# Altium project fyp_drone_V3.PrjPcb
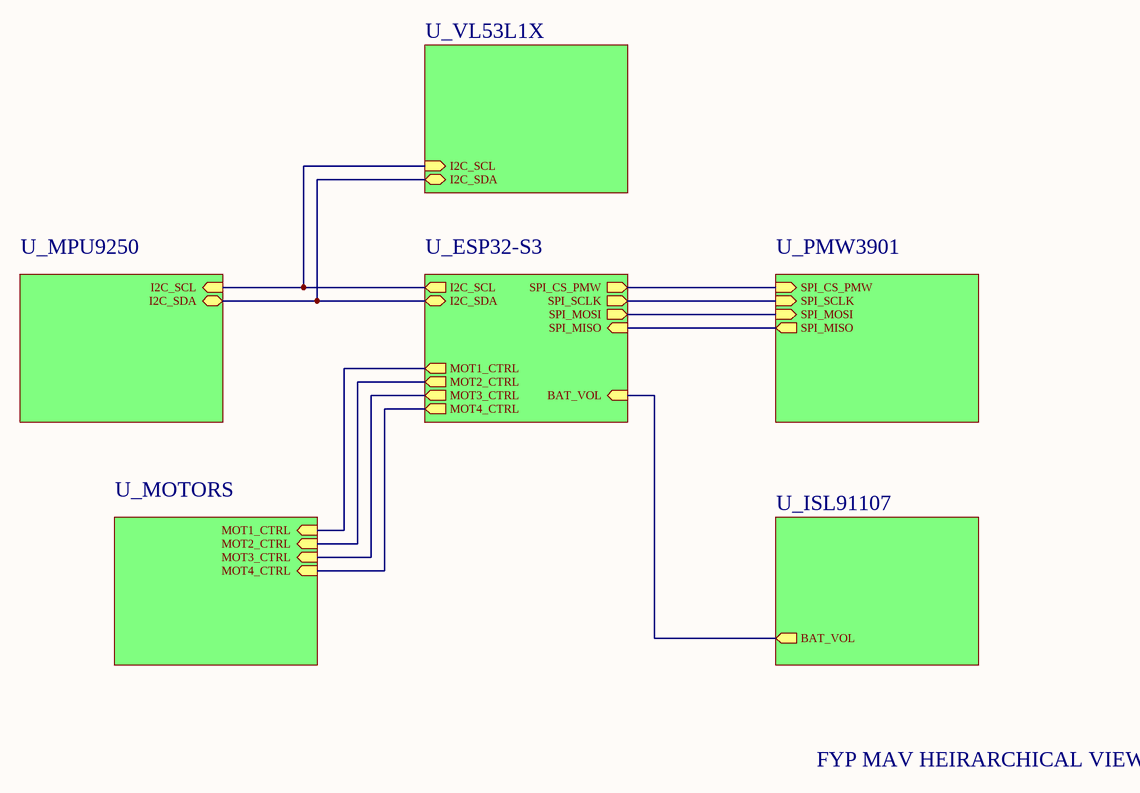
[diagram p0: TOP.SchDoc]
7 sheets, 66 parts. Net scope: hierarchical (ports join the sheet entries above them; power ports are global).
Board file: PCB1.PcbDoc
Sheets:
  TOP.SchDoc
    U_ESP32-S3 = ESP32-S3.SchDoc
    U_MPU9250 = MPU9250.SchDoc
    U_PMW3901 = PMW3901.SchDoc
    U_ISL91107 = ISL91107.SchDoc
    U_VL53L1X = VL53L1X.SchDoc
    U_MOTORS = MOTORS.SchDoc

## Sheet TOP.SchDoc
size A4; SheetNumber: 1; SheetTotal: 7

### Sub-sheets
U_ESP32-S3 = ESP32-S3.SchDoc: I2C_SDA (bidir), I2C_SCL (out), SPI_CS_PMW (out), SPI_MISO (in), SPI_SCLK (out), SPI_MOSI (out), BAT_VOL (in), MOT2_CTRL (out), MOT1_CTRL (out), MOT4_CTRL (out), MOT3_CTRL (out)
U_ISL91107 = ISL91107.SchDoc: BAT_VOL (out)
U_MOTORS = motors.SchDoc: MOT1_CTRL (in), MOT2_CTRL (in), MOT3_CTRL (in), MOT4_CTRL (in)
U_MPU9250 = MPU9250.schdoc: I2C_SCL (in), I2C_SDA (bidir)
U_PMW3901 = PMW3901.SchDoc: SPI_CS_PMW (in), SPI_MISO (out), SPI_SCLK (in), SPI_MOSI (in)
U_VL53L1X = VL53L1X.SchDoc: I2C_SDA (bidir), I2C_SCL (in)

### Nets
BAT_VOL: sheet U_ESP32-S3/BAT_VOL, sheet U_ISL91107/BAT_VOL
I2C_SCL: sheet U_ESP32-S3/I2C_SCL, sheet U_MPU9250/I2C_SCL, sheet U_VL53L1X/I2C_SCL
I2C_SDA: sheet U_ESP32-S3/I2C_SDA, sheet U_MPU9250/I2C_SDA, sheet U_VL53L1X/I2C_SDA
MOT1_CTRL: sheet U_ESP32-S3/MOT1_CTRL, sheet U_MOTORS/MOT1_CTRL
MOT2_CTRL: sheet U_ESP32-S3/MOT2_CTRL, sheet U_MOTORS/MOT2_CTRL
MOT3_CTRL: sheet U_ESP32-S3/MOT3_CTRL, sheet U_MOTORS/MOT3_CTRL
MOT4_CTRL: sheet U_ESP32-S3/MOT4_CTRL, sheet U_MOTORS/MOT4_CTRL
SPI_CS_PMW: sheet U_ESP32-S3/SPI_CS_PMW, sheet U_PMW3901/SPI_CS_PMW
SPI_MISO: sheet U_ESP32-S3/SPI_MISO, sheet U_PMW3901/SPI_MISO
SPI_MOSI: sheet U_ESP32-S3/SPI_MOSI, sheet U_PMW3901/SPI_MOSI
SPI_SCLK: sheet U_ESP32-S3/SPI_SCLK, sheet U_PMW3901/SPI_SCLK

### Notes on the sheet
- FYP MAV HEIRARCHICAL VIEW

## Sheet ESP32-S3.SchDoc
size A4; SheetNumber: 2; SheetTotal: 7
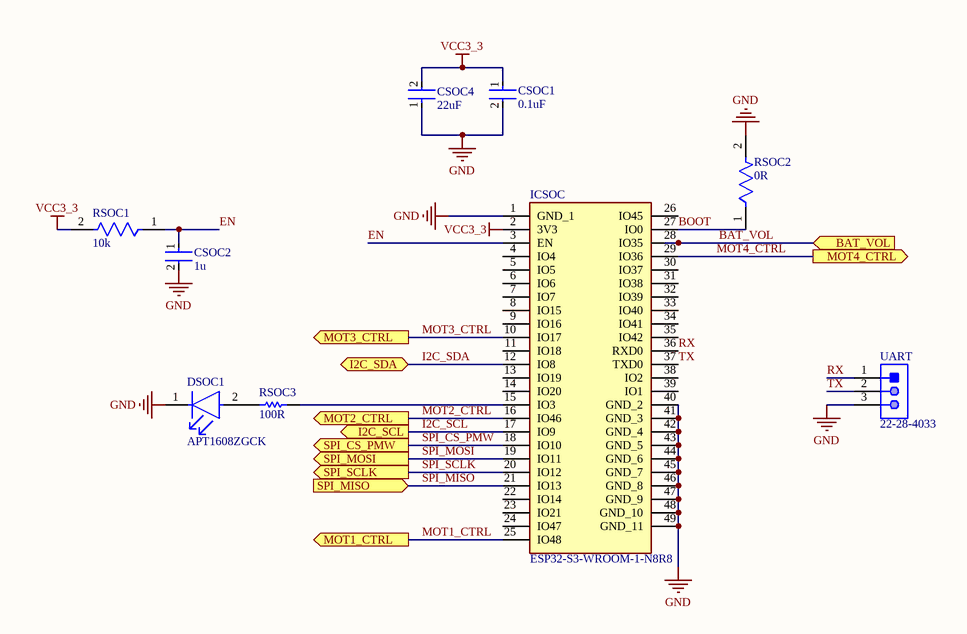
[diagram p1: ESP32-S3.SchDoc]

### Parts
CSOC1  0.1uF  [FP-CL10-IPC_C]
CSOC2  1u  [FP-CL10-IPC_A]
CSOC4  22uF  [FP-GRM188-0_2-IPC_C]
DSOC1  APT1608ZGCK  [FP-APT1608ZGCK-MFG]
ICSOC  ESP32-S3-WROOM-1-N8R8  [ESP32S3WROOM1N8R8]
RSOC1  10k  [FP-ERJ3G-IPC_C]
RSOC2  0R  [FP-ERJ-3GEY0R00V-MFG]
RSOC3  100R  [RESC1608X55X30LL15T15]
UART  22-28-4033  [MOLX-22-28-4033_V]

### Ports
BAT_VOL (in), I2C_SCL (out), I2C_SDA (bidir), MOT1_CTRL (out), MOT2_CTRL (out), MOT3_CTRL (out), MOT4_CTRL (out), SPI_CS_PMW (out), SPI_MISO (in), SPI_MOSI (out), SPI_SCLK (out)

### Nets
GND: CSOC1.2 CSOC2.2 CSOC4.1 DSOC1.1(C) ICSOC.1(GND_1) ICSOC.40(GND_2) ICSOC.41(GND_3) ICSOC.42(GND_4) ICSOC.43(GND_5) ICSOC.44(GND_6) ICSOC.45(GND_7) ICSOC.46(GND_8) ICSOC.47(GND_9) ICSOC.48(GND_10) ICSOC.49(GND_11) RSOC2.2 UART.3
VCC3_3: CSOC1.1 CSOC4.2 ICSOC.2(3V3) RSOC1.2  [project net AVDD]
BAT_VOL: ICSOC.28(IO35) ; port BAT_VOL
BOOT: ICSOC.27(IO0) RSOC2.1
EN: CSOC2.1 ICSOC.3(EN) RSOC1.1
I2C_SCL: ICSOC.17(IO9) ; port I2C_SCL
I2C_SDA: ICSOC.12(IO8) ; port I2C_SDA
MOT1_CTRL: ICSOC.25(IO48) ; port MOT1_CTRL
MOT2_CTRL: ICSOC.16(IO46) ; port MOT2_CTRL
MOT3_CTRL: ICSOC.10(IO17) ; port MOT3_CTRL
MOT4_CTRL: ICSOC.29(IO36) ; port MOT4_CTRL
RX: ICSOC.36(RXD0) UART.1
SPI_CS_PMW: ICSOC.18(IO10) ; port SPI_CS_PMW
SPI_MISO: ICSOC.21(IO13) ; port SPI_MISO
SPI_MOSI: ICSOC.19(IO11) ; port SPI_MOSI
SPI_SCLK: ICSOC.20(IO12) ; port SPI_SCLK
TX: ICSOC.37(TXD0) UART.2
NetDSOC1_2: DSOC1.2(A) RSOC3.2
NetICSOC_15: ICSOC.15(IO3) RSOC3.1

Not connected (* = marked no-connect by the designer): ICSOC 4(IO4) 5(IO5) 6(IO6) 7(IO7) 8(IO15) 9(IO16) 11(IO18) 13(IO19) 14(IO20) 22(IO14) 23(IO21) 24(IO47) 26(IO45) 30(IO37) 31(IO38) 32(IO39) 33(IO40) 34(IO41) 35(IO42) 38(IO2) 39(IO1)

### Library data of the parts
CSOC1 = CMP-13271-001724-1: Cap Ceramic 100nF 50V X7R ±20% Pad SMD 0603 +125°C T/R; Mount: Surface Mount; Lead Free: Lead Free; Max Operating Temperature: 125°C; Voltage Rating: 50V; Case Code (Imperial): 0603; Capacitance: 100nF; Height: 0.8mm; Length: 1.6mm; Tolerance: 20%; Case Code (Metric): 1608; Thickness: 0.035inch; Depth: 0.8mm; Width: 0.031inch; Package Quantity: 1; Min Operating Temperature: -55°C; Case/Package: 0603; Radiation Hardening: No; Voltage Rating (DC): 50V; Dielectric: X7R; Packaging: Tape and Reel
CSOC2 = CMP-13271-001174-1: Cap Ceramic 1uF 25V X5R ±10% Pad SMD 0603 +85°C T/R; Min Operating Temperature: -55°C; Dielectric: X5R; Mount: Surface Mount; Lead Free: Lead Free; Capacitance: 1uF; Height: 0.8mm; Case/Package: 0603; Depth: 0.8mm; Radiation Hardening: No; Width: 0.031inch; Tolerance: 10%; Voltage Rating: 25V; Thickness: 0.035inch; Max Operating Temperature: 85°C; Packaging: Tape and Reel; Package Quantity: 15000; Length: 1.6mm; Voltage Rating (DC): 25V
CSOC4 = CMP-2000-06337-3: Chip Multilayer Ceramic Capacitors for General Purpose, 0603, 22uF, X5R, 15%, 20%, 10V; Tolerance: 20%; Weight: 0.000222oz; Material: Ceramic; Depth: 0.8mm; Length: 1.6mm; Termination: SMD/SMT; Capacitance: 22uF; Packaging: Tape and Reel; Width: 0.8mm; Voltage Rating: 10V; Case Code (Imperial): 0603; Mount: Surface Mount; Voltage Rating (DC): 10V; Case/Package: 0603; Thickness: 0.039inch; REACH SVHC: No SVHC; Dielectric: X5R; Height: 0.8mm; Package Quantity: 4000; Case Code (Metric): 1608; Min Operating Temperature: -55°C; Lead Free: Lead Free; Max Operating Temperature: 85°C
DSOC1 = CMP-44529-000024-1: LED GREEN CLEAR CHIP SMD; Forward Voltage: 3.3V; Dominant Wavelength: 525nm; Forward Current: 20mA; Lens Color: Colorless; Viewing Angle: 120°; Luminous Intensity: 350mcd; Lens Transparency: Clear; Color: Green; Max Operating Temperature: 85°C; Case/Package: 0603; Mount: Surface Mount; Min Operating Temperature: -40°C; Case Code (Metric): 1608; Test Current: 20mA; Packaging: Tape and Reel; Width: 0.8mm; Package Quantity: 1; Height: 0.75mm; Length: 1.6mm; Illumination Color: Green; Lead Free: Lead Free; Case Code (Imperial): 0603
ICSOC = CMP-006-000000-1: Integrated Circuit; Manufacturer_Name: Espressif Systems; Datasheet Link: https://www.espressif.com/sites/default/files/documentation/esp32-s3-wroom-1_wroom-1u_datasheet_en.pdf; Source: SamacSys.SchLib; Manufacturer_Part_Number: ESP32-S3-WROOM-1-N8R8; Height: 3.25mm; Design Item ID: ESP32-S3-WROOM-1-N8R8
RSOC1 = CMP-2000-00704-2: RES SMD 10K OHM 5% 1/10W 0603; Temperature Coefficient: 200ppm/°C; Max Power Dissipation: 100mW; Resistance: 10kR; Voltage Rating (DC): 50V; Voltage Rating: 75V; Resistor Type: Thick Film; Tolerance: 5%; Military Standard: Not; Package Quantity: 1; Max Operating Temperature: 155°C; Mount: Surface Mount; Technology: THICK FILM; Case/Package: 0603; Construction: Rectangular; Depth: 0.8mm; Case Code (Imperial): 0603; Weight: 7.1E-05oz; Features: Automotive AEC-Q200; Packaging: Tape and Reel; Width: 0.8mm; Length: 1.6mm; Termination: SMD/SMT; Power Rating: 100mW; Lead Free: Lead Free; Number of Terminations: 2; Height: 0.45mm; RoHS Compliant: Yes; Min Operating Temperature: -55°C; Contact Plating: Tin; REACH SVHC: No SVHC; Resistance Tolerance: 5%; Series: ERJ; Working Voltage: 75V; Case Code (Metric): 1608
RSOC2 = CMP-2000-00700-2: RES SMD 0 OHM JUMPER 1/10W 0603; Manufacturer Part Number: ERJ-3GEY0R00V; Manufacturer: Panasonic; Tolerance: 5%; Description: 0 Ohms Jumper 0.1W, 1/10W Chip Resistor 0603 (1608 Metric) Automotive AEC-Q200 Thick Film; Automotive Grade: Grade 0; Voltage Rating: 75V; Value: 0Ω; Temperature Coefficient: -100/+600ppm/°C; Power Rating: 0.1W; Mouser Description: Resistor, Chip Thick Film, 0 Ohm, 0.1w, Resistor, Chip Thick Film, 0 Ohm, 0.1w, 5%; Ipc Land Pattern Name: RESC16080X45; Category: Res; Package: 0603; Temperature: -55°C to +155°C; Temperature Range Low: -55°C; Series: ERJ; Resistance: 0Ω; RoHS: TRUE; Composition: Thick Film; Octopart: https://octopart.com/erj-3gey0r00v-panasonic-55389238; Device Class L1: Passive Components; Footprint Url: https://industrial.panasonic.com/cdbs/www-data/pdf/RDA0000/DMA0000COL17.pdf; ComponentLink2Description: Datasheet; Device Class L2: Resistors; Temperature Range High: +155°C; Digikey Description: RES SMD 0 OHM JUMPER 1/10W 0603; Lead Free: Yes; Device Class L3: Chip SMD Resistors; Height: 0.55mm; ComponentLink2URL: https://industrial.panasonic.com/cdbs/www-data/pdf/RDA0000/AOA0000C301.pdf; Automotive: Yes
RSOC3 = CMP-2000-00179-1: Manufacturer: Panasonic; Part Number: ERJ-3EKF1000V
UART = CMP-1676-00001-5: Male Header, Pitch 2.54 mm, 1 x 3 Position, Height 8.38 mm, Tail Length 3.18 mm, RoHS, Bulk; Manufacturer: Molex; Rows: 1; Voltage Rating: 250 V; Current Rating: 4 A; Min Operating Temperature: 0 degC; Lead Pitch: 0.1 inch; Packaging: Bulk; Contact Finish: Gold; RoHSCompliant: true; Contact Material: Brass; PackageReference: 22-28-4033; REACH SVHC: Unknown; PackageDescription: Male Header, Pitch 2.54 mm, 1 x 3 Position, Height 8.38 mm, Tail Length 3.18 mm; ComponentLink2URL: http://www.molex.com/pdm_docs/sd/022284033_sd.pdf; Height: 8.38 mm; Mounting Technology: Through Hole; ComponentLink1Description: Manufacturer URL; Length: 7.62 mm; Mount: Through Hole; DatasheetVersion: Rev. G, 01/2012; Max Operating Temperature: 75 degC; ComponentLink2Description: Datasheet; Colour: Black; Pins: 3; Contact Plating: Gold; Package Quantity: 1; ComponentLink1URL: http://www.molex.com/

## Sheet MPU9250.SchDoc
size A4; SheetNumber: 3; SheetTotal: 7
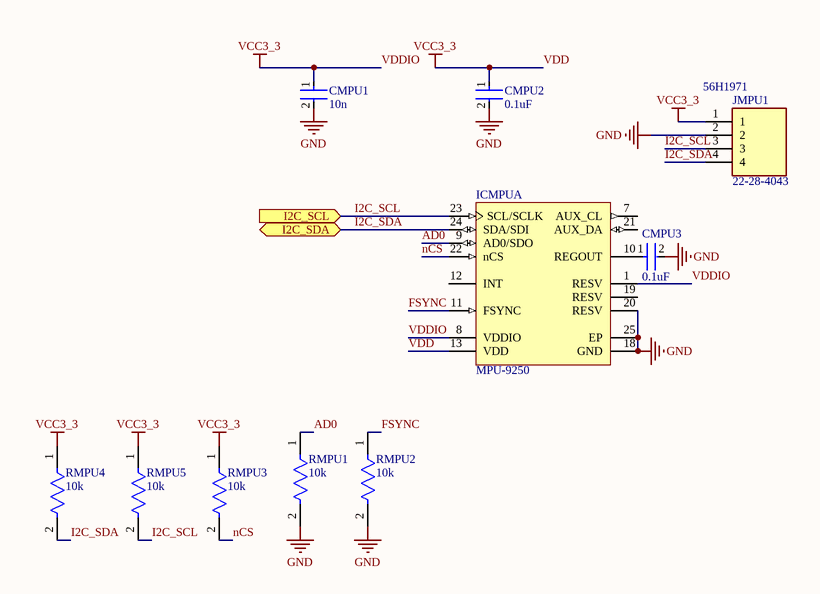
[diagram p2: MPU9250.SchDoc]

### Parts
CMPU1  10n  [FP-CL10-IPC_A]
CMPU2  0.1uF  [FP-CL10-IPC_C]
CMPU3  0.1uF  [FP-CL10-IPC_C]
ICMPU  MPU-9250  [INSE-QFN-24-1700X1540TP_M]  (part A of 2)
JMPU1  22-28-4043  Supplier Part Number 1: 56H1971  [HDRV4W87P0X254_1X4_1016X249X863P]
RMPU1  10k  [FP-ERJ3G-IPC_C]
RMPU2  10k  [FP-ERJ3G-IPC_C]
RMPU3  10k  [FP-ERJ3G-IPC_C]
RMPU4  10k  [FP-ERJ3G-IPC_C]
RMPU5  10k  [FP-ERJ3G-IPC_C]

### Ports
I2C_SCL (in), I2C_SDA (bidir)

### Nets
GND: CMPU1.2 CMPU2.2 CMPU3.2 ICMPU.18(GND) ICMPU.20(RESV) ICMPU.25(EP) JMPU1.2 RMPU1.2 RMPU2.2
VCC3_3: CMPU1.1 CMPU2.1 ICMPU.1(RESV) ICMPU.8(VDDIO) ICMPU.13(VDD) JMPU1.1 RMPU3.1 RMPU4.1 RMPU5.1  [also labelled VDD, VDDIO]  [project net AVDD]
AD0: ICMPU.9(AD0/SDO) RMPU1.1
FSYNC: ICMPU.11(FSYNC) RMPU2.1
I2C_SCL: ICMPU.23(SCL/SCLK) JMPU1.3 RMPU5.2 ; port I2C_SCL
I2C_SDA: ICMPU.24(SDA/SDI) JMPU1.4 RMPU4.2 ; port I2C_SDA
nCS: ICMPU.22(nCS) RMPU3.2
NetCMPU3_1: CMPU3.1 ICMPU.10(REGOUT)

Not connected (* = marked no-connect by the designer): ICMPU 7(AUX_CL) 12(INT) 19(RESV) 21(AUX_DA)

### Library data of the parts
CMPU1 = CMP-13271-001215-1: Cap Ceramic 10nF 50V X7R ±10% Pad SMD 0603 +125°C T/R; Dielectric: X7R; Features: Soft Termination; Packaging: Tape and Reel; Voltage Rating: 50V; Ratings: AEC-Q200; Radiation Hardening: No; Height: 0.8mm; Package Quantity: 4000; Case Code (Metric): 1608; Capacitance: 10nF; Length: 1.6mm; Width: 0.031inch; Case/Package: 0603; Thickness: 0.035inch; Tolerance: 10%; Max Operating Temperature: 125°C; Lead Free: Lead Free; Mount: Surface Mount; Min Operating Temperature: -55°C; Case Code (Imperial): 0603; Voltage: 50V; Depth: 0.8mm
CMPU2 CMPU3 = CMP-13271-001724-1: as CSOC1 on sheet ESP32-S3; Mount: Surface Mount; Lead Free: Lead Free; Max Operating Temperature: 125°C; Voltage Rating: 50V; Case Code (Imperial): 0603; Capacitance: 100nF; Height: 0.8mm; Length: 1.6mm; Tolerance: 20%; Case Code (Metric): 1608; Thickness: 0.035inch; Depth: 0.8mm; Width: 0.031inch; Package Quantity: 1; Min Operating Temperature: -55°C; Case/Package: 0603; Radiation Hardening: No; Voltage Rating (DC): 50V; Dielectric: X7R; Packaging: Tape and Reel
ICMPU = CMP-010-00006-3: 9-axis MotionTracking device, 2.4 to 3,6 V, -40 to 85 degC, 24-Pin QFN, RoHS, Tape and Reel; Manufacturer: InvenSense; Sensor Type: Motion; Max Supply Voltage: 3.6V; Min Supply Voltage: 2.4V; Package Description: 24-Pin Quad Flat No-lead Package, Body 3 x 3 mm, Pitch 0.4 mm; RoHS Compliant: True; Datasheet Version: Rev. 1.0, 01/2014; Pins: 24; Mounting Technology: SM; Datasheet URL: http://datasheet.octopart.com/MPU-9250-InvenSense-datasheet-21859386.pdf; Package Quantity: 5000; Package Reference: QFN-24; Case/Package: Module
JMPU1 = 22-28-4043: Connector; Manufacturer_Name: Molex; Datasheet Link: http://www.molex.com/molex/products/datasheet.jsp?part=active/0022284023_PCB_HEADERS.xml; Height: 8.63mm; Manufacturer_Part_Number: 22-28-4043; Mouser Part Number: 538-22-28-4043; Mouser Price/Stock: https://www.mouser.co.uk/ProductDetail/Molex/22-28-4043?qs=MuwpYaHj751%252Bm8qLwZDsXA%3D%3D; Supplier 1: Newark
RMPU1-RMPU5 = CMP-2000-00704-2: as RSOC1 on sheet ESP32-S3; Resistor Type: Thick Film; Tolerance: 5%; Military Standard: Not; Package Quantity: 1; Max Operating Temperature: 155°C; Mount: Surface Mount; Technology: THICK FILM; Case/Package: 0603; Construction: Rectangular; Depth: 0.8mm; Case Code (Imperial): 0603; Weight: 7.1E-05oz; Features: Automotive AEC-Q200; Packaging: Tape and Reel; Width: 0.8mm; Length: 1.6mm; Termination: SMD/SMT; Power Rating: 100mW; Lead Free: Lead Free; Number of Terminations: 2; Height: 0.45mm; RoHS Compliant: Yes; Min Operating Temperature: -55°C; Contact Plating: Tin; REACH SVHC: No SVHC; Resistance Tolerance: 5%; Series: ERJ; Working Voltage: 75V; Case Code (Metric): 1608

## Sheet PMW3901.SchDoc
size A4; SheetNumber: 4; SheetTotal: 7
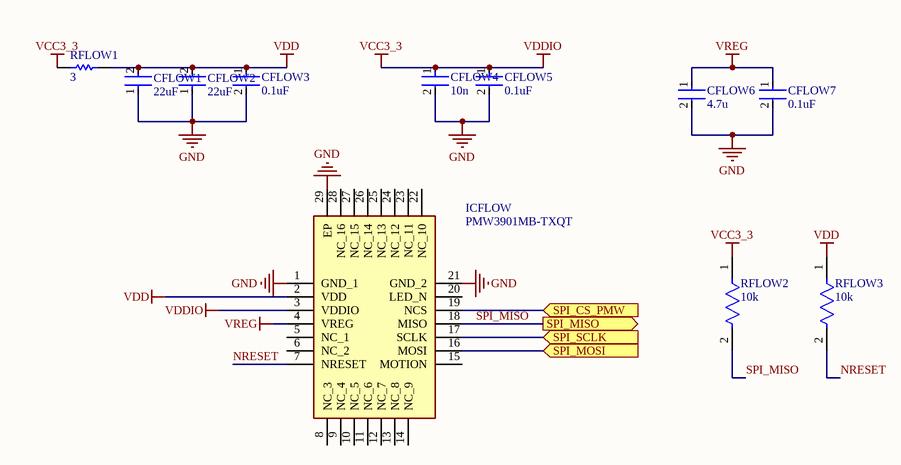
[diagram p3: PMW3901.SchDoc]

### Parts
CFLOW1  22uF  [FP-GRM188-0_2-IPC_C]
CFLOW2  22uF  [FP-GRM188-0_2-IPC_C]
CFLOW3  0.1uF  [FP-CL10-IPC_C]
CFLOW4  10n  [FP-CL10-IPC_A]
CFLOW5  0.1uF  [FP-CL10-IPC_C]
CFLOW6  4.7u  [FP-CL10-IPC_C]
CFLOW7  0.1uF  [FP-CL10-IPC_C]
ICFLOW  PMW3901MB-TXQT  [PMW3901MBTXQT]
RFLOW1  3  [RESC1608X55X30NL15T15]
RFLOW2  10k  [FP-ERJ3G-IPC_C]
RFLOW3  10k  [FP-ERJ3G-IPC_C]

### Ports
SPI_CS_PMW (in), SPI_MISO (out), SPI_MOSI (in), SPI_SCLK (in)

### Nets
GND: CFLOW1.1 CFLOW2.1 CFLOW3.2 CFLOW4.2 CFLOW5.2 CFLOW6.2 CFLOW7.2 ICFLOW.1(GND_1) ICFLOW.21(GND_2) ICFLOW.29(EP)
VCC3_3: CFLOW4.1 CFLOW5.1 ICFLOW.3(VDDIO) RFLOW1.1 RFLOW2.1  [also labelled VDDIO]  [project net AVDD]
VDD: CFLOW1.2 CFLOW2.2 CFLOW3.1 ICFLOW.2(VDD) RFLOW1.2 RFLOW3.1
VREG: CFLOW6.1 CFLOW7.1 ICFLOW.4(VREG)
NRESET: ICFLOW.7(NRESET) RFLOW3.2
SPI_CS_PMW: ICFLOW.19(NCS) ; port SPI_CS_PMW
SPI_MISO: ICFLOW.18(MISO) RFLOW2.2 ; port SPI_MISO
SPI_MOSI: ICFLOW.16(MOSI) ; port SPI_MOSI
SPI_SCLK: ICFLOW.17(SCLK) ; port SPI_SCLK

Not connected (* = marked no-connect by the designer): ICFLOW 5(NC_1) 6(NC_2) 8(NC_3) 9(NC_4) 10(NC_5) 11(NC_6) 12(NC_7) 13(NC_8) 14(NC_9) 15(MOTION) 20(LED_N) 22(NC_10) 23(NC_11) 24(NC_12) 25(NC_13) 26(NC_14) 27(NC_15) 28(NC_16)

### Library data of the parts
CFLOW1 CFLOW2 = CMP-2000-06337-3: as CSOC4 on sheet ESP32-S3; Tolerance: 20%; Weight: 0.000222oz; Material: Ceramic; Depth: 0.8mm; Length: 1.6mm; Termination: SMD/SMT; Capacitance: 22uF; Packaging: Tape and Reel; Width: 0.8mm; Voltage Rating: 10V; Case Code (Imperial): 0603; Mount: Surface Mount; Voltage Rating (DC): 10V; Case/Package: 0603; Thickness: 0.039inch; REACH SVHC: No SVHC; Dielectric: X5R; Height: 0.8mm; Package Quantity: 4000; Case Code (Metric): 1608; Min Operating Temperature: -55°C; Lead Free: Lead Free; Max Operating Temperature: 85°C
CFLOW3 CFLOW5 CFLOW7 = CMP-13271-001724-1: as CSOC1 on sheet ESP32-S3; Mount: Surface Mount; Lead Free: Lead Free; Max Operating Temperature: 125°C; Voltage Rating: 50V; Case Code (Imperial): 0603; Capacitance: 100nF; Height: 0.8mm; Length: 1.6mm; Tolerance: 20%; Case Code (Metric): 1608; Thickness: 0.035inch; Depth: 0.8mm; Width: 0.031inch; Package Quantity: 1; Min Operating Temperature: -55°C; Case/Package: 0603; Radiation Hardening: No; Voltage Rating (DC): 50V; Dielectric: X7R; Packaging: Tape and Reel
CFLOW4 = CMP-13271-001215-1: as CMPU1 on sheet MPU9250; Dielectric: X7R; Features: Soft Termination; Packaging: Tape and Reel; Voltage Rating: 50V; Ratings: AEC-Q200; Radiation Hardening: No; Height: 0.8mm; Package Quantity: 4000; Case Code (Metric): 1608; Capacitance: 10nF; Length: 1.6mm; Width: 0.031inch; Case/Package: 0603; Thickness: 0.035inch; Tolerance: 10%; Max Operating Temperature: 125°C; Lead Free: Lead Free; Mount: Surface Mount; Min Operating Temperature: -55°C; Case Code (Imperial): 0603; Voltage: 50V; Depth: 0.8mm
CFLOW6 = CMP-13271-003017-1: Cap Ceramic 4.7uF 10V X5R ±10% Pad SMD 0603 +85°C T/R; Capacitance: 4.7uF; Case/Package: 0603; Packaging: Tape and Reel; Width: 0.031inch; Contact Plating: Tin; Thickness: 0.035inch; Package Quantity: 1; Voltage Rating: 10V; Case Code (Metric): 1608; Case Code (Imperial): 0603; Depth: 0.8mm; Height: 0.8mm; Tolerance: 10%; Max Operating Temperature: 85°C; Length: 1.6mm; Dielectric: X5R; Mount: Surface Mount; Radiation Hardening: No; Min Operating Temperature: -55°C
ICFLOW = PMW3901MB-TXQT: Integrated Circuit; Manufacturer_Name: PixArt Imaging Inc.; Height: 2.36mm; Manufacturer_Part_Number: PMW3901MB-TXQT
RFLOW1 = CMP-2000-00787-1: Manufacturer: Panasonic; Part Number: ERJ-3GEYJ3R0V
RFLOW2 RFLOW3 = CMP-2000-00704-2: as RSOC1 on sheet ESP32-S3; Resistor Type: Thick Film; Tolerance: 5%; Military Standard: Not; Package Quantity: 1; Max Operating Temperature: 155°C; Mount: Surface Mount; Technology: THICK FILM; Case/Package: 0603; Construction: Rectangular; Depth: 0.8mm; Case Code (Imperial): 0603; Weight: 7.1E-05oz; Features: Automotive AEC-Q200; Packaging: Tape and Reel; Width: 0.8mm; Length: 1.6mm; Termination: SMD/SMT; Power Rating: 100mW; Lead Free: Lead Free; Number of Terminations: 2; Height: 0.45mm; RoHS Compliant: Yes; Min Operating Temperature: -55°C; Contact Plating: Tin; REACH SVHC: No SVHC; Resistance Tolerance: 5%; Series: ERJ; Working Voltage: 75V; Case Code (Metric): 1608

## Sheet ISL91107.SchDoc
size A4; SheetNumber: 6; SheetTotal: 7
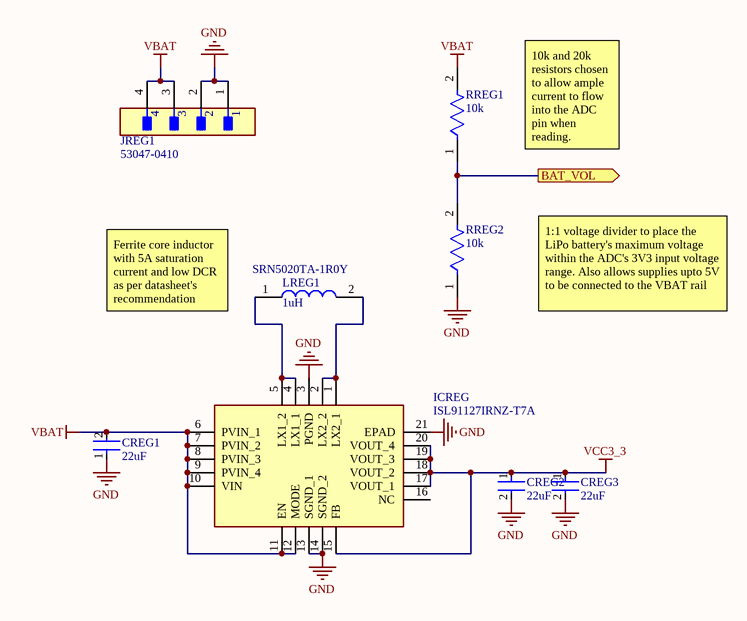
[diagram p4: ISL91107.SchDoc]

### Parts
CREG1  22uF  [FP-GRM188-0_2-IPC_C]
CREG2  22uF  [FP-GRM188-0_2-IPC_C]
CREG3  22uF  [FP-GRM188-0_2-IPC_C]
ICREG  ISL91127IRNZ-T7A  [QFN50P400X400X100-21N]
JREG1  53047-0410  [FP-53047-0410-MFG]
LREG1  1uH  [INDC5050X200N]
RREG1  10k  [FP-ERJ3G-IPC_C]
RREG2  10k  [FP-ERJ3G-IPC_C]

### Ports
BAT_VOL (out)

### Nets
GND: CREG1.1 CREG2.2 CREG3.2 ICREG.3(PGND) ICREG.13(SGND_1) ICREG.14(SGND_2) ICREG.21(EPAD) JREG1.1 JREG1.2 RREG2.1
VBAT: CREG1.2 ICREG.6(PVIN_1) ICREG.7(PVIN_2) ICREG.8(PVIN_3) ICREG.9(PVIN_4) ICREG.10(VIN) ICREG.11(EN) ICREG.12(MODE) JREG1.3 JREG1.4 RREG1.2
VCC3_3: CREG2.1 CREG3.1 ICREG.15(FB) ICREG.17(VOUT_1) ICREG.18(VOUT_2) ICREG.19(VOUT_3) ICREG.20(VOUT_4)  [project net AVDD]
BAT_VOL: RREG1.1 RREG2.2 ; port BAT_VOL
NetICREG_1: ICREG.1(LX2_1) ICREG.2(LX2_2) LREG1.2
NetICREG_4: ICREG.4(LX1_1) ICREG.5(LX1_2) LREG1.1

Not connected (* = marked no-connect by the designer): ICREG 16(NC)

### Notes on the sheet
- 10k and 20k resistors chosen to allow ample current to flow into the ADC pin when reading.
  QREG1 closes the path when the ADC is not in use to reduce leakage current
- Ferrite core inductor with 5A saturation current and low DCR as per datasheet's recommendation
- 1:1 voltage divider to place the LiPo battery's maximum voltage within the ADC's 3V3 input voltage range. Also allows supplies upto 5V to be connected to the VBAT rail

### Library data of the parts
CREG1-CREG3 = CMP-2000-06337-3: as CSOC4 on sheet ESP32-S3; Tolerance: 20%; Weight: 0.000222oz; Material: Ceramic; Depth: 0.8mm; Length: 1.6mm; Termination: SMD/SMT; Capacitance: 22uF; Packaging: Tape and Reel; Width: 0.8mm; Voltage Rating: 10V; Case Code (Imperial): 0603; Mount: Surface Mount; Voltage Rating (DC): 10V; Case/Package: 0603; Thickness: 0.039inch; REACH SVHC: No SVHC; Dielectric: X5R; Height: 0.8mm; Package Quantity: 4000; Case Code (Metric): 1608; Min Operating Temperature: -55°C; Lead Free: Lead Free; Max Operating Temperature: 85°C
ICREG = ISL91127IRNZ-T7A: Integrated Circuit; Manufacturer_Name: Renesas Electronics; Datasheet Link: https://www.renesas.com/en-us/www/doc/datasheet/isl91127ir.pdf; Height: 1mm; Manufacturer_Part_Number: ISL91127IRNZ-T7A; Mouser Part Number: 968-ISL91127IRNZ-T7A; Mouser Price/Stock: https://www.mouser.co.uk/ProductDetail/Renesas-Intersil/ISL91127IRNZ-T7A?qs=MbhLeWKW1It6pBrhIpi7Yg%3D%3D; Supplier 1: Mouser; Supplier Part Number 1: 968-ISL91127IRNZ-T7A
JREG1 = CMP-04776-000321-1: CONN HEADER VERT 4POS 1.25MM; Plating: Tin; Number of Positions: 4; Voltage Rating (AC): 125V; Insulation Resistance: 100MR; Current Rating: 1A; Glow Wire Compliant: Non-compliant; Contact Resistance: 20mR; Gender: Male; Series: PicoBlade; Contact Material: Bronze; Number of Circuits: 4; Voltage Rating (DC): 125V; Working Voltage: 125V; Termination: Solder; Pitch: 1.25mm; Housing Material: Polyamide; Orientation: Vertical; Current: 1A; Flammability Rating: UL94 V-0; Max Voltage Rating (AC): 125V; Housing Color: Natural; Package Quantity: 5000; Mount: Through Hole; Case/Package: 0410; Max Operating Temperature: 85°C; RoHS Compliant: Yes; Voltage Rating: 125V; Lead Free: Lead Free; Packaging: Tray; Color: Natural; Contact Plating: Tin; Number of Rows: 1; Radiation Hardening: No; Min Operating Temperature: -40°C; Voltage: 125V; Number of Contacts: 4
LREG1 = SRN5020TA-1R0Y: Inductor; Manufacturer_Name: Bourns; Datasheet Link: https://www.mouser.com/datasheet/2/54/bourns_09242018_SRN5020TA_datasheet-1483446.pdf; Height: 2mm; Manufacturer_Part_Number: SRN5020TA-1R0Y; Mouser Part Number: 652-SRN5020TA-1R0Y; Mouser Price/Stock: https://www.mouser.co.uk/ProductDetail/Bourns/SRN5020TA-1R0Y?qs=qSfuJ%252Bfl%2Fd5ZUICL%252BTn9FA%3D%3D; Arrow Part Number: SRN5020TA-1R0Y; Arrow Price/Stock: https://www.arrow.com/en/products/srn5020ta-1r0y/bourns?region=nac; Supplier 1: Arrow Electronics; Supplier Part Number 1: SRN5020TA-1R0Y
RREG1 RREG2 = CMP-2000-00704-2: as RSOC1 on sheet ESP32-S3; Resistor Type: Thick Film; Tolerance: 5%; Military Standard: Not; Package Quantity: 1; Max Operating Temperature: 155°C; Mount: Surface Mount; Technology: THICK FILM; Case/Package: 0603; Construction: Rectangular; Depth: 0.8mm; Case Code (Imperial): 0603; Weight: 7.1E-05oz; Features: Automotive AEC-Q200; Packaging: Tape and Reel; Width: 0.8mm; Length: 1.6mm; Termination: SMD/SMT; Power Rating: 100mW; Lead Free: Lead Free; Number of Terminations: 2; Height: 0.45mm; RoHS Compliant: Yes; Min Operating Temperature: -55°C; Contact Plating: Tin; REACH SVHC: No SVHC; Resistance Tolerance: 5%; Series: ERJ; Working Voltage: 75V; Case Code (Metric): 1608

## Sheet VL53L1X.SchDoc
size A4; SheetNumber: 5; SheetTotal: 7
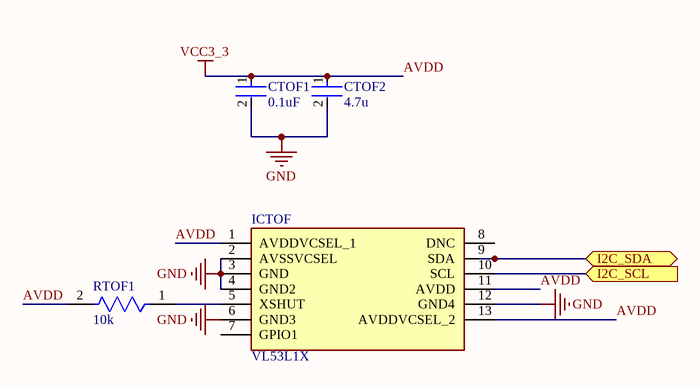
[diagram p5: VL53L1X.SchDoc]

### Parts
CTOF1  0.1uF  [FP-CL10-IPC_C]
CTOF2  4.7u  [FP-CL10-IPC_C]
ICTOF  VL53L1X  [VL53L1X]
RTOF1  10k  [FP-ERJ3G-IPC_C]

### Ports
I2C_SCL (in), I2C_SDA (bidir)

### Nets
AVDD: CTOF1.1 CTOF2.1 ICTOF.1(AVDDVCSEL_1) ICTOF.11(AVDD) ICTOF.13(AVDDVCSEL_2) RTOF1.2  [also labelled VCC3_3]
GND: CTOF1.2 CTOF2.2 ICTOF.2(AVSSVCSEL) ICTOF.3(GND) ICTOF.4(GND2) ICTOF.6(GND3) ICTOF.12(GND4)
I2C_SCL: ICTOF.10(SCL) ; port I2C_SCL
I2C_SDA: ICTOF.9(SDA) ; port I2C_SDA
NetICTOF_5: ICTOF.5(XSHUT) RTOF1.1

Not connected (* = marked no-connect by the designer): ICTOF 7(GPIO1) 8(DNC)

### Library data of the parts
CTOF1 = CMP-13271-001724-1: as CSOC1 on sheet ESP32-S3; Mount: Surface Mount; Lead Free: Lead Free; Max Operating Temperature: 125°C; Voltage Rating: 50V; Case Code (Imperial): 0603; Capacitance: 100nF; Height: 0.8mm; Length: 1.6mm; Tolerance: 20%; Case Code (Metric): 1608; Thickness: 0.035inch; Depth: 0.8mm; Width: 0.031inch; Package Quantity: 1; Min Operating Temperature: -55°C; Case/Package: 0603; Radiation Hardening: No; Voltage Rating (DC): 50V; Dielectric: X7R; Packaging: Tape and Reel
CTOF2 = CMP-13271-003017-1: as CFLOW6 on sheet PMW3901; Capacitance: 4.7uF; Case/Package: 0603; Packaging: Tape and Reel; Width: 0.031inch; Contact Plating: Tin; Thickness: 0.035inch; Package Quantity: 1; Voltage Rating: 10V; Case Code (Metric): 1608; Case Code (Imperial): 0603; Depth: 0.8mm; Height: 0.8mm; Tolerance: 10%; Max Operating Temperature: 85°C; Length: 1.6mm; Dielectric: X5R; Mount: Surface Mount; Radiation Hardening: No; Min Operating Temperature: -55°C
ICTOF = CMP-006-000005-1: Integrated Circuit; Manufacturer_Name: STMicroelectronics; Datasheet Link: https://www.st.com/resource/en/datasheet/vl53l1x.pdf; Source: SamacSys.SchLib; Manufacturer_Part_Number: VL53L1X; Height: 1.6mm; Design Item ID: VL53L1X
RTOF1 = CMP-2000-00704-2: as RSOC1 on sheet ESP32-S3; Resistor Type: Thick Film; Tolerance: 5%; Military Standard: Not; Package Quantity: 1; Max Operating Temperature: 155°C; Mount: Surface Mount; Technology: THICK FILM; Case/Package: 0603; Construction: Rectangular; Depth: 0.8mm; Case Code (Imperial): 0603; Weight: 7.1E-05oz; Features: Automotive AEC-Q200; Packaging: Tape and Reel; Width: 0.8mm; Length: 1.6mm; Termination: SMD/SMT; Power Rating: 100mW; Lead Free: Lead Free; Number of Terminations: 2; Height: 0.45mm; RoHS Compliant: Yes; Min Operating Temperature: -55°C; Contact Plating: Tin; REACH SVHC: No SVHC; Resistance Tolerance: 5%; Series: ERJ; Working Voltage: 75V; Case Code (Metric): 1608

## Sheet MOTORS.SchDoc
size A4; SheetNumber: 7; SheetTotal: 7
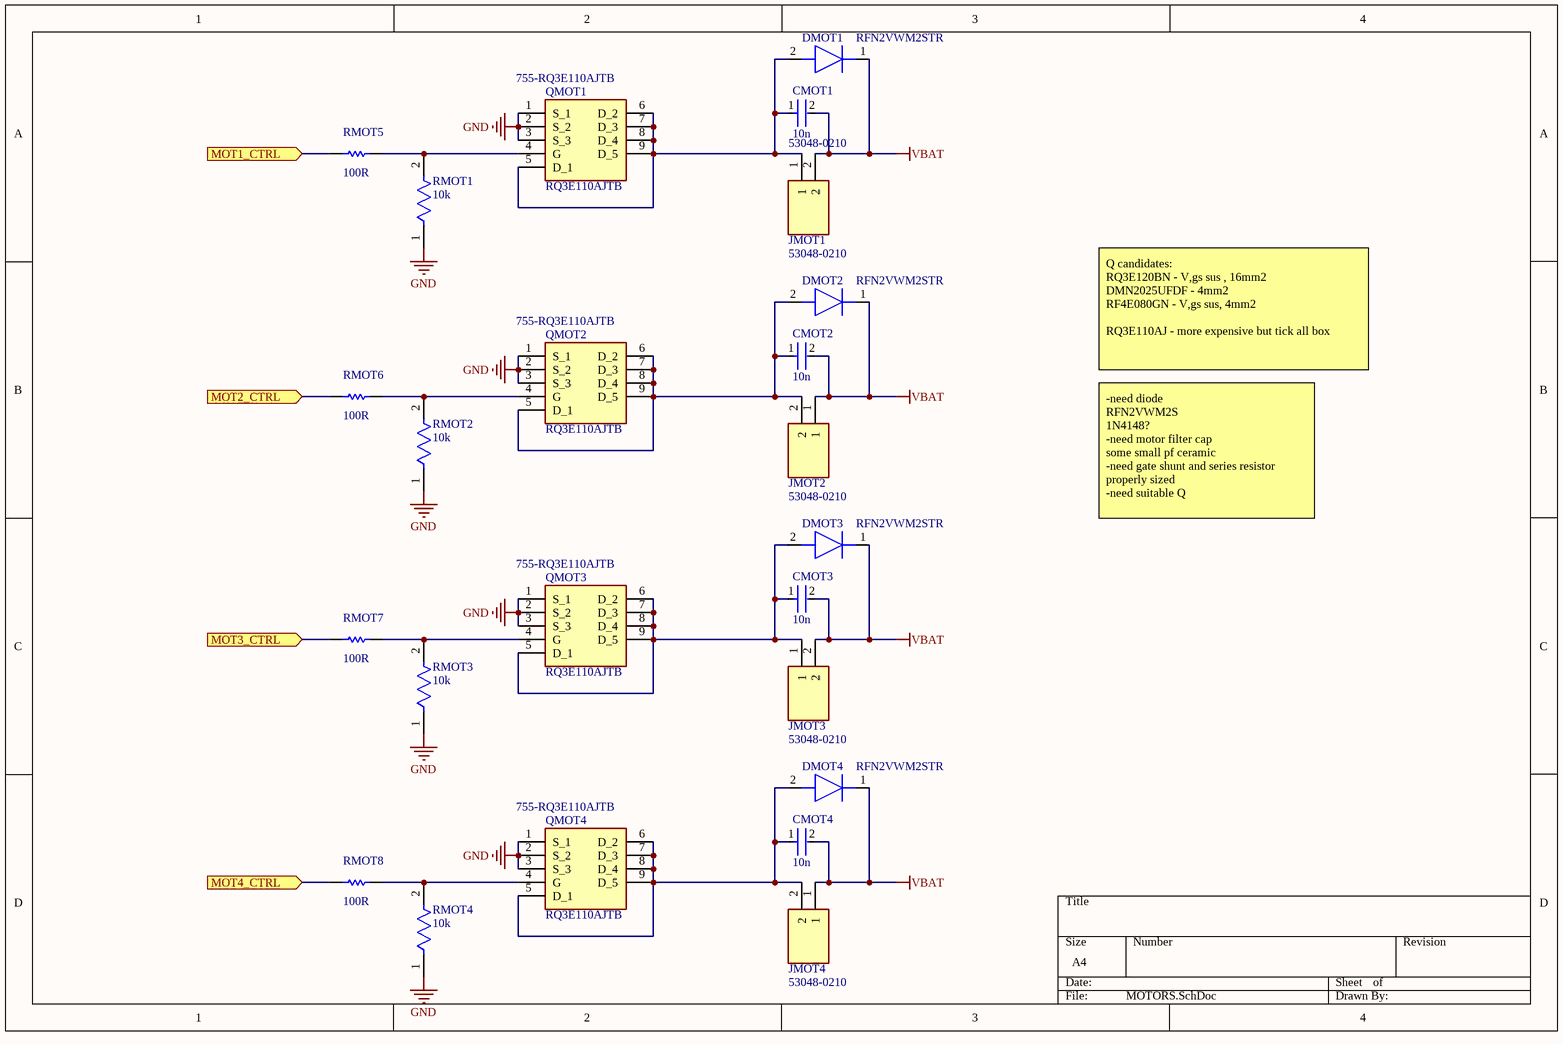
[diagram p6: MOTORS.SchDoc]

### Parts
CMOT1  10n  [FP-CL10-IPC_A]
CMOT2  10n  [FP-CL10-IPC_A]
CMOT3  10n  [FP-CL10-IPC_A]
CMOT4  10n  [FP-CL10-IPC_A]
DMOT1  RFN2VWM2STR  [RFN2VWM2STR]
DMOT2  RFN2VWM2STR  [RFN2VWM2STR]
DMOT3  RFN2VWM2STR  [RFN2VWM2STR]
DMOT4  RFN2VWM2STR  [RFN2VWM2STR]
JMOT1  53048-0210  [SHDRRA2W35P0X125_1X2_425X550X350P]
JMOT2  53048-0210  [SHDRRA2W35P0X125_1X2_425X550X350P]
JMOT3  53048-0210  [SHDRRA2W35P0X125_1X2_425X550X350P]
JMOT4  53048-0210  [SHDRRA2W35P0X125_1X2_425X550X350P]
QMOT1  RQ3E110AJTB  Supplier Part Number 1: 755-RQ3E110AJTB  [RQ3E110AJTB]
QMOT2  RQ3E110AJTB  Supplier Part Number 1: 755-RQ3E110AJTB  [RQ3E110AJTB]
QMOT3  RQ3E110AJTB  Supplier Part Number 1: 755-RQ3E110AJTB  [RQ3E110AJTB]
QMOT4  RQ3E110AJTB  Supplier Part Number 1: 755-RQ3E110AJTB  [RQ3E110AJTB]
RMOT1  10k  [FP-ERJ3G-IPC_C]
RMOT2  10k  [FP-ERJ3G-IPC_C]
RMOT3  10k  [FP-ERJ3G-IPC_C]
RMOT4  10k  [FP-ERJ3G-IPC_C]
RMOT5  100R  [RESC1608X55X30LL15T15]
RMOT6  100R  [RESC1608X55X30LL15T15]
RMOT7  100R  [RESC1608X55X30LL15T15]
RMOT8  100R  [RESC1608X55X30LL15T15]

### Ports
MOT1_CTRL (in), MOT2_CTRL (in), MOT3_CTRL (in), MOT4_CTRL (in)

### Nets
GND: QMOT1.1(S_1) QMOT1.2(S_2) QMOT1.3(S_3) QMOT2.1(S_1) QMOT2.2(S_2) QMOT2.3(S_3) QMOT3.1(S_1) QMOT3.2(S_2) QMOT3.3(S_3) QMOT4.1(S_1) QMOT4.2(S_2) QMOT4.3(S_3) RMOT1.1 RMOT2.1 RMOT3.1 RMOT4.1
VBAT: CMOT1.2 CMOT2.2 CMOT3.2 CMOT4.2 DMOT1.1(K) DMOT2.1(K) DMOT3.1(K) DMOT4.1(K) JMOT1.2 JMOT2.1 JMOT3.2 JMOT4.1
MOT1_CTRL: RMOT5.1 ; port MOT1_CTRL
MOT2_CTRL: RMOT6.1 ; port MOT2_CTRL
MOT3_CTRL: RMOT7.1 ; port MOT3_CTRL
MOT4_CTRL: RMOT8.1 ; port MOT4_CTRL
NetCMOT1_1: CMOT1.1 DMOT1.2(A) JMOT1.1 QMOT1.5(D_1) QMOT1.6(D_2) QMOT1.7(D_3) QMOT1.8(D_4) QMOT1.9(D_5)
NetCMOT2_1: CMOT2.1 DMOT2.2(A) JMOT2.2 QMOT2.5(D_1) QMOT2.6(D_2) QMOT2.7(D_3) QMOT2.8(D_4) QMOT2.9(D_5)
NetCMOT3_1: CMOT3.1 DMOT3.2(A) JMOT3.1 QMOT3.5(D_1) QMOT3.6(D_2) QMOT3.7(D_3) QMOT3.8(D_4) QMOT3.9(D_5)
NetCMOT4_1: CMOT4.1 DMOT4.2(A) JMOT4.2 QMOT4.5(D_1) QMOT4.6(D_2) QMOT4.7(D_3) QMOT4.8(D_4) QMOT4.9(D_5)
NetQMOT1_4: QMOT1.4(G) RMOT1.2 RMOT5.2
NetQMOT2_4: QMOT2.4(G) RMOT2.2 RMOT6.2
NetQMOT3_4: QMOT3.4(G) RMOT3.2 RMOT7.2
NetQMOT4_4: QMOT4.4(G) RMOT4.2 RMOT8.2

### Notes on the sheet
- Q candidates:
  RQ3E120BN - V,gs sus , 16mm2
  DMN2025UFDF - 4mm2
  RF4E080GN - V,gs sus, 4mm2
  RQ3E110AJ - more expensive but tick all box
- -need diode
  RFN2VWM2S
  1N4148?
  -need motor filter cap
  some small pf ceramic
  -need gate shunt and series resistor properly sized
  -need suitable Q

### Library data of the parts
CMOT1-CMOT4 = CMP-13271-001215-1: as CMPU1 on sheet MPU9250; Dielectric: X7R; Features: Soft Termination; Packaging: Tape and Reel; Voltage Rating: 50V; Ratings: AEC-Q200; Radiation Hardening: No; Height: 0.8mm; Package Quantity: 4000; Case Code (Metric): 1608; Capacitance: 10nF; Length: 1.6mm; Width: 0.031inch; Case/Package: 0603; Thickness: 0.035inch; Tolerance: 10%; Max Operating Temperature: 125°C; Lead Free: Lead Free; Mount: Surface Mount; Min Operating Temperature: -55°C; Case Code (Imperial): 0603; Voltage: 50V; Depth: 0.8mm
DMOT1-DMOT4 = CMP-009-000000-1: Diodes - General Purpose; Manufacturer_Name: ROHM Semiconductor; Height: 1mm; Source: SamacSys.SchLib; Manufacturer_Part_Number: RFN2VWM2STR; Mouser Part Number: 755-RFN2VWM2STR; Design Item ID: RFN2VWM2STR; Datasheet Link: https://fscdn.rohm.com/en/products/databook/datasheet/discrete/diode/fast_recovery/rfn2vwm2str-e.pdf; Mouser Price/Stock: https://www.mouser.co.uk/ProductDetail/ROHM-Semiconductor/RFN2VWM2STR?qs=MyNHzdoqoQLG6Du3HymTWQ%3D%3D
JMOT1-JMOT4 = 53048-0210: Connector; Manufacturer_Name: Molex; Datasheet Link: https://www.molex.com/pdm_docs/sd/530481010_sd.pdf; Height: 3.5mm; Manufacturer_Part_Number: 53048-0210; Mouser Part Number: 538-53048-0210; Mouser Price/Stock: https://www.mouser.co.uk/ProductDetail/Molex/53048-0210?qs=o4r9IV%252BgZWMoVY43HmKPkg%3D%3D
  JMOT1: Supplier 1: Arrow Electronics; Supplier Part Number 1: 53048-0210
QMOT1-QMOT4 = RQ3E110AJTB: MOSFET (N-Channel); Manufacturer_Name: ROHM Semiconductor; Datasheet Link: https://fscdn.rohm.com/en/products/databook/datasheet/discrete/transistor/mosfet/rq3e110ajtb-e.pdf; Height: 0.95mm; Manufacturer_Part_Number: RQ3E110AJTB; Mouser Part Number: 755-RQ3E110AJTB; Mouser Price/Stock: https://www.mouser.co.uk/ProductDetail/ROHM-Semiconductor/RQ3E110AJTB/?qs=4v%252BiZTmLVHGt3DMv0H7VeQ%3D%3D; Supplier 1: Mouser
RMOT1-RMOT4 = CMP-2000-00704-2: as RSOC1 on sheet ESP32-S3; Resistor Type: Thick Film; Tolerance: 5%; Military Standard: Not; Package Quantity: 1; Max Operating Temperature: 155°C; Mount: Surface Mount; Technology: THICK FILM; Case/Package: 0603; Construction: Rectangular; Depth: 0.8mm; Case Code (Imperial): 0603; Weight: 7.1E-05oz; Features: Automotive AEC-Q200; Packaging: Tape and Reel; Width: 0.8mm; Length: 1.6mm; Termination: SMD/SMT; Power Rating: 100mW; Lead Free: Lead Free; Number of Terminations: 2; Height: 0.45mm; RoHS Compliant: Yes; Min Operating Temperature: -55°C; Contact Plating: Tin; REACH SVHC: No SVHC; Resistance Tolerance: 5%; Series: ERJ; Working Voltage: 75V; Case Code (Metric): 1608
RMOT5-RMOT8 = CMP-2000-00179-1: as RSOC3 on sheet ESP32-S3

## Nets that join several sheets
AVDD: ESP32-S3 (CSOC1.1 CSOC4.2 ICSOC.2 RSOC1.2), MPU9250 (9 pins), PMW3901 (5 pins), ISL91107 (7 pins), VL53L1X (6 pins)
GND: ESP32-S3 (17 pins), MPU9250 (9 pins), PMW3901 (10 pins), ISL91107 (10 pins), VL53L1X (7 pins), MOTORS (16 pins)
VBAT: ISL91107 (11 pins), MOTORS (12 pins)
BAT_VOL: ESP32-S3 (ICSOC.28), ISL91107 (RREG1.1 RREG2.2)
I2C_SCL: ESP32-S3 (ICSOC.17), MPU9250 (ICMPU.23 JMPU1.3 RMPU5.2), VL53L1X (ICTOF.10)
I2C_SDA: ESP32-S3 (ICSOC.12), MPU9250 (ICMPU.24 JMPU1.4 RMPU4.2), VL53L1X (ICTOF.9)
MOT1_CTRL: ESP32-S3 (ICSOC.25), MOTORS (RMOT5.1)
MOT2_CTRL: ESP32-S3 (ICSOC.16), MOTORS (RMOT6.1)
MOT3_CTRL: ESP32-S3 (ICSOC.10), MOTORS (RMOT7.1)
MOT4_CTRL: ESP32-S3 (ICSOC.29), MOTORS (RMOT8.1)
SPI_CS_PMW: ESP32-S3 (ICSOC.18), PMW3901 (ICFLOW.19)
SPI_MISO: ESP32-S3 (ICSOC.21), PMW3901 (ICFLOW.18 RFLOW2.2)
SPI_MOSI: ESP32-S3 (ICSOC.19), PMW3901 (ICFLOW.16)
SPI_SCLK: ESP32-S3 (ICSOC.20), PMW3901 (ICFLOW.17)